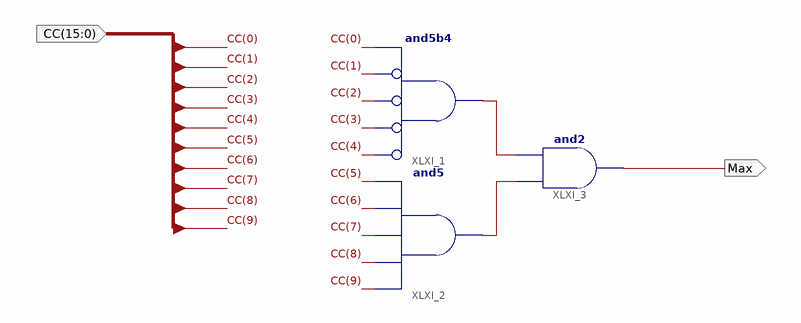
[diagram p0: schematic sheet 1]
// Xilinx ISE schematic maxF.sch (spartan3e) as structural Verilog: 3 symbols, 2 ports
module maxF (
  input  [15:0] CC,
  output Max
);

  wire XLXN_29, XLXN_30;

  and XLXI_1 (XLXN_30, ~CC[4], ~CC[3], ~CC[2], ~CC[1], CC[0]);  // and5b4
  and XLXI_2 (XLXN_29, CC[9], CC[8], CC[7], CC[6], CC[5]);
  and XLXI_3 (Max, XLXN_29, XLXN_30);
endmodule
